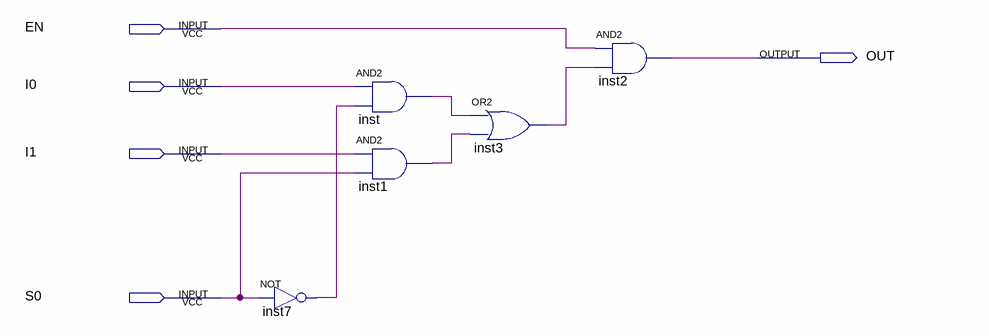
[diagram p0: schematic sheet]
// Quartus schematic MP2_1.bdf as structural Verilog: 5 symbols, 5 pins
module MP2_1 (
  input  EN,
  input  I0,
  input  I1,
  input  S0,
  output OUT
);

  wire inst1_out, inst3_out, inst7_out, inst_out;

  not inst7 (inst7_out, S0);
  and inst (inst_out, I0, inst7_out);
  and inst1 (inst1_out, I1, S0);
  or inst3 (inst3_out, inst_out, inst1_out);
  and inst2 (OUT, EN, inst3_out);
endmodule
